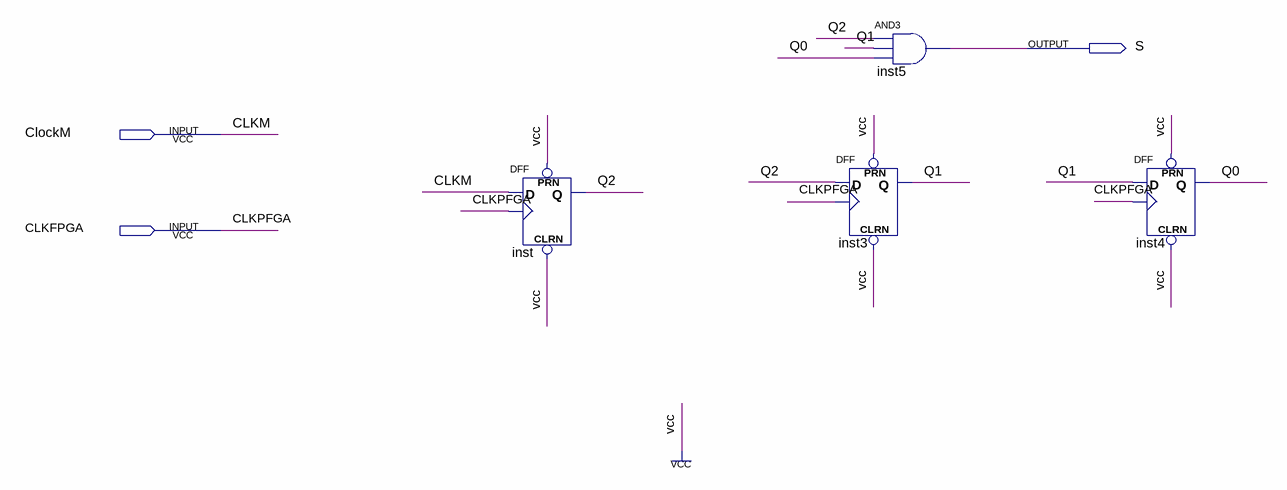
[diagram p0: schematic sheet]
// Quartus schematic Debounce.bdf as structural Verilog: 4 symbols, 3 pins
module Debounce (
  input  ClockM,
  input  CLKFPGA,
  output S
);

  wire Q0, Q1, Q2;

  DFF inst (.CLRN(1'b1), .CLK(CLKFPGA), .D(ClockM), .PRN(1'b1), .Q(Q2));
  and inst5 (S, Q2, Q1, Q0);
  DFF inst3 (.CLRN(1'b1), .CLK(CLKFPGA), .D(Q2), .PRN(1'b1), .Q(Q1));
  DFF inst4 (.CLRN(1'b1), .CLK(CLKFPGA), .D(Q1), .PRN(1'b1), .Q(Q0));

  // Other names for the same wires on the sheet: CLKM = ClockM; CLKPFGA = CLKFPGA
endmodule
